# Altium schematic sheet Gate_Drive.SchDoc
size A4
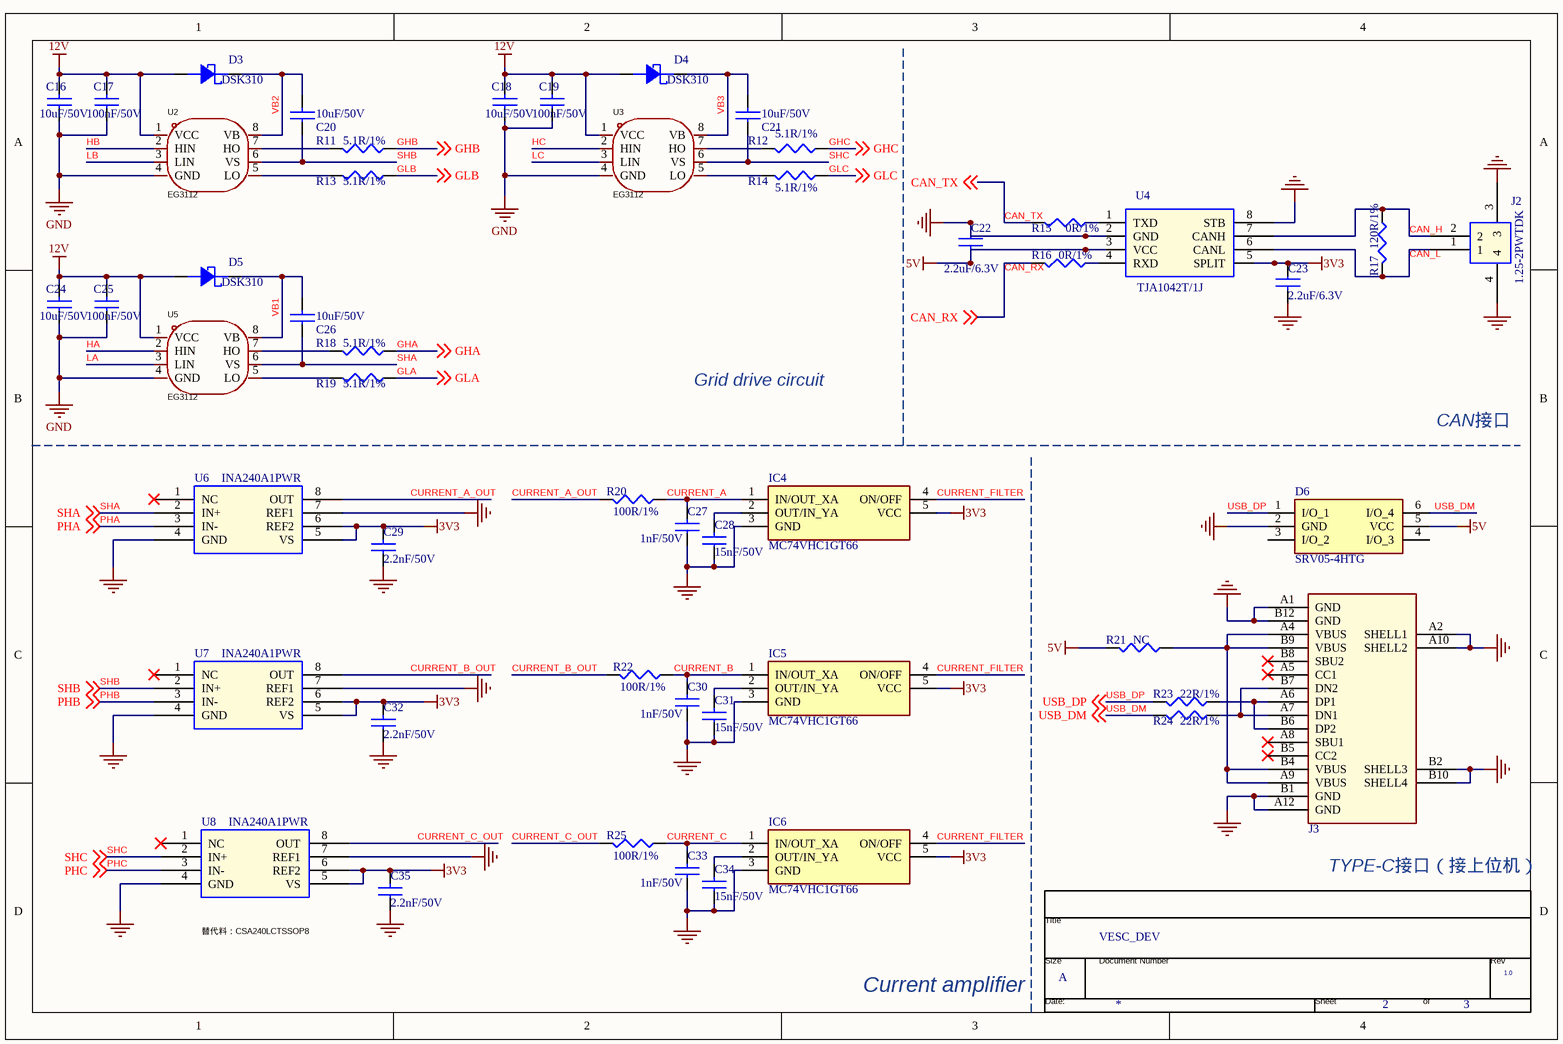
[diagram p0: Gate_Drive.SchDoc]

## Parts
*  Page Count: 3  Page Number: 2  Page Size: A  Title: VESC_DEV  RevCode: 1.0  (hidden comment: TitleBlock0)  (graphical)
C16  10uF/50V  [C0603]
C17  100nF/50V  [C0603]
C18  10uF/50V  [C0603]
C19  100nF/50V  [C0603]
C20  10uF/50V  [C0603]
C21  10uF/50V  [C0603]
C22  2.2uF/6.3V  [C0402]
C23  2.2uF/6.3V  [C0402]
C24  10uF/50V  [C0603]
C25  100nF/50V  [C0603]
C26  10uF/50V  [C0603]
C27  1nF/50V  [C0402]
C28  15nF/50V  [C0402]
C29  2.2nF/50V  [C0402]
C30  1nF/50V  [C0402]
C31  15nF/50V  [C0402]
C32  2.2nF/50V  [C0402]
C33  1nF/50V  [C0402]
C34  15nF/50V  [C0402]
C35  2.2nF/50V  [C0402]
D3  DSK310  [SOD-123F]
D4  DSK310  [SOD-123F]
D5  DSK310  [SOD-123F]
D6  SRV05-4HTG  [SOT95P280X145-6N]
IC4  MC74VHC1GT66  [SOT95P275X110-5N]
IC5  MC74VHC1GT66  [SOT95P275X110-5N]
IC6  MC74VHC1GT66  [SOT95P275X110-5N]
J2  1.25-2PWTDK  [SMD-2P-1_25]
J3  TYPE-C 16PLC-H10.0  [TYPE-C-TH_16PLC-H10.0]  (value not drawn)
R11  5.1R/1%  [R0603]
R12  5.1R/1%  [R0603]
R13  5.1R/1%  [R0603]
R14  5.1R/1%  [R0603]
R15  0R/1%  [R0402]
R16  0R/1%  [R0402]
R17  120R/1%  [R0402]
R18  5.1R/1%  [R0603]
R19  5.1R/1%  [R0603]
R20  100R/1%  [R0402]
R21  NC  [R0603]
R22  100R/1%  [R0402]
R23  22R/1%  [R0402]
R24  22R/1%  [R0402]
R25  100R/1%  [R0402]
U2  EG3112  [SOIC-8_L4.9-W3.9-P1.27-LS6.0-BL]
U3  EG3112  [SOIC-8_L4.9-W3.9-P1.27-LS6.0-BL]
U4  TJA1042T/1J  [SOP-8]
U5  EG3112  [SOIC-8_L4.9-W3.9-P1.27-LS6.0-BL]
U6  INA240A1PWR  [TSSOP-8]
U7  INA240A1PWR  [TSSOP-8]
U8  INA240A1PWR  [TSSOP-8]

## Nets
3V3: C23.1 C29.2 C32.2 C35.2 IC4.5(VCC) IC5.5(VCC) IC6.5(VCC) U4.5(SPLIT) U6.5(VS) U6.6(REF2) U7.5(VS) U7.6(REF2) U8.5(VS) U8.6(REF2)
5V: C22.2 D6.5(VCC) R21.2 U4.3(VCC)
12V: C16.2 C17.2 C18.2 C19.2 C24.2 C25.2 D3.2(A) D4.2(A) D5.2(A) U2.1(VCC) U3.1(VCC) U5.1(VCC)
GND: C16.1 C17.1 C18.1 C19.1 C22.1 C23.2 C24.1 C25.1 C27.1 C28.1 C29.1 C30.1 C31.1 C32.1 C33.1 C34.1 C35.1 D6.2(GND) IC4.3(GND) IC5.3(GND) IC6.3(GND) J2.3 J2.4 J3.A1(GND) J3.A2(SHELL1) J3.A10(SHELL2) J3.A12(GND) J3.B1(GND) J3.B2(SHELL3) J3.B10(SHELL4) J3.B12(GND) U2.4(GND) U3.4(GND) U4.2(GND) U4.8(STB) U5.4(GND) U6.4(GND) U6.7(REF1) U7.4(GND) U7.7(REF1) U8.4(GND) U8.7(REF1)
CAN_H: J2.2 R17.1 U4.7(CANH)
CAN_L: J2.1 R17.2 U4.6(CANL)
CAN_RX: R16.2 ; off-sheet CAN_RX
CAN_TX: R15.2 ; off-sheet CAN_TX
CURRENT_A: C27.2 IC4.1(IN/OUT_XA) R20.1
CURRENT_A_OUT: R20.2 U6.8(OUT)
CURRENT_B: C30.2 IC5.1(IN/OUT_XA) R22.1
CURRENT_B_OUT: R22.2 U7.8(OUT)
CURRENT_C: C33.2 IC6.1(IN/OUT_XA) R25.1
CURRENT_C_OUT: R25.2 U8.8(OUT)
CURRENT_FILTER: IC4.4(ON/OFF) IC5.4(ON/OFF) IC6.4(ON/OFF)
GHA: R18.1 ; off-sheet GHA
GHB: R11.1 ; off-sheet GHB
GHC: R12.1 ; off-sheet GHC
GLA: R19.1 ; off-sheet GLA
GLB: R13.1 ; off-sheet GLB
GLC: R14.1 ; off-sheet GLC
HA: U5.2(HIN)
HB: U2.2(HIN)
HC: U3.2(HIN)
LA: U5.3(LIN)
LB: U2.3(LIN)
LC: U3.3(LIN)
PHA: U6.3(IN-) ; off-sheet PHA
PHB: U7.3(IN-) ; off-sheet PHB
PHC: U8.3(IN-) ; off-sheet PHC
SHA: C26.1 U5.6(VS) U6.2(IN+) ; off-sheet SHA
SHB: C20.1 U2.6(VS) U7.2(IN+) ; off-sheet SHB
SHC: C21.1 U3.6(VS) U8.2(IN+) ; off-sheet SHC
USB_DM: D6.6(I/O_4) R24.2 ; off-sheet USB_DM
USB_DP: D6.1(I/O_1) R23.2 ; off-sheet USB_DP
VB1: C26.2 D5.1(K) U5.8(VB)
VB2: C20.2 D3.1(K) U2.8(VB)
VB3: C21.2 D4.1(K) U3.8(VB)
NetC28_2: C28.2 IC4.2(OUT/IN_YA)
NetC31_2: C31.2 IC5.2(OUT/IN_YA)
NetC34_2: C34.2 IC6.2(OUT/IN_YA)
NetJ3_A4: J3.A4(VBUS) J3.A9(VBUS) J3.B4(VBUS) J3.B9(VBUS) R21.1
NetJ3_A6: J3.A6(DP1) J3.B6(DP2) R23.1
NetJ3_A7: J3.A7(DN1) J3.B7(DN2) R24.1
NetR11_2: R11.2 U2.7(HO)
NetR12_2: R12.2 U3.7(HO)
NetR13_2: R13.2 U2.5(LO)
NetR14_2: R14.2 U3.5(LO)
NetR15_1: R15.1 U4.1(TXD)
NetR16_1: R16.1 U4.4(RXD)
NetR18_2: R18.2 U5.7(HO)
NetR19_2: R19.2 U5.5(LO)

Not connected (* = marked no-connect by the designer): D6 3(I/O_2) 4(I/O_3); J3 A5(CC1)* A8(SBU1)* B5(CC2)* B8(SBU2)*; U6 1(NC)*; U7 1(NC)*; U8 1(NC)*

## Notes on the sheet
- Grid drive circuit
- CAN接口
- (near U8) 替代料：CSA240LCTSSOP8
- (near J3) TYPE-C接口（接上位机）
- Current amplifier
- (in symbol TitleBlock0) Title; Size; Document Number; Rev; Date:; Sheet; of

## Library data of the parts
C16-C35 = CAP NP
  C16-C21 C24-C26: PCB Footprint: C0603
  C22 C23 C27-C35: PCB Footprint: C0402
D3-D5 = DIODE SCHOTTKY21: PCB Footprint: SOD-123F
D6 = SRV05-4HTG: TVS Diode (Uni-directional); Manufacturer_Name: LITTELFUSE; Datasheet Link: https://componentsearchengine.com/Datasheets/2/SRV05-4HTG.pdf; Height: 1.45mm; Manufacturer_Part_Number: SRV05-4HTG; Mouser Part Number: 576-SRV05-4HTG; Mouser Price/Stock: https://www.mouser.co.uk/ProductDetail/Littelfuse/SRV05-4HTG?qs=TI15CVqcli3Liexbf3C%2FVA%3D%3D; Arrow Part Number: SRV05-4HTG; Arrow Price/Stock: https://www.arrow.com/en/products/srv05-4htg/littelfuse?region=nac
IC4-IC6 = MC74VHC1GT66: Integrated Circuit; Manufacturer_Name: onsemi; Datasheet Link: https://pdf1.alldatasheet.com/datasheet-pdf/view/148919/ETL/MC74VHC1GT66.html; Height: 1.1mm; Manufacturer_Part_Number: MC74VHC1GT66; Mouser Part Number: N/A; Mouser Price/Stock: https://www.mouser.co.uk/ProductDetail/onsemi/MC74VHC1GT66?qs=YA77FY0Msbu77w80Y0DYXA%3D%3D
J3 = TYPE-C 16PLC-H10.0: 连接器类型:Type-C;标准:USB 3.1;公母:母;安装方式:直插;触点数量:16P;端口数量:1;额定电流 - 电源:5A;触头材质:-;触头镀层:-;工作温度范围:-40℃~+85℃;; Manufacturer: SHOU HAN(首韩); Add into BOM: yes; Gender: 母; Number of Contacts: 16P; Number of Ports: 1; Current Rating - Power (Max): 5A; Rated Voltage (Max): 20V; Connect-Disconnect Life: 1万次; Core Colour: 黑色; Symbol: TYPE-C 16PLC-H10.0; Device: TYPE-C 16PLC-H10.0; LCSC Part Name: Type-C 母 直插; Supplier Part: C3151747; Manufacturer Part: TYPE-C 16PLC-H10.0; Supplier Footprint: 插件; Datasheet: https://atta.szlcsc.com/upload/public/pdf/source/20240529/CC9428849977884A813B584EA396EFE9.pdf; Supplier: LCSC; Convert to PCB: yes; Connector Type: Type-C; Standard: USB 3.1; Mounting Style: 直插; Contact Material: -; Contact Plating: -; Operating Temperature Range: -40℃~+85℃
R11-R14 R18 R19 = RESISTOR: PCB Footprint: R0402
R15-R17 R20-R25 = RESISTOR
  R15-R17 R20 R22-R25: PCB Footprint: R0402
  R21: PCB Footprint: R0603
U2 U3 U5 = EG3112: Manufacturer: EG(屹晶微); Add into BOM: yes; Symbol: EG3112; Device: EG3112; LCSC Part Name: EG3112; Supplier Part: C111908; Manufacturer Part: EG3112; Supplier Footprint: SOIC-8; JLCPCB Part Class: Extended Part; Datasheet: https://atta.szlcsc.com/upload/public/pdf/source/20230725/3992D5BD05E91E0CBB5D3EE72F4B3B26.pdf; Supplier: LCSC; Convert to PCB: yes
* = TitleBlock0: Page Create Date: March  8, 1995; Page Modify Date: *
J2 = 1.25-2PWTDK: PCB Footprint: SMD-2P-1_25
U4 = TJA1042T/1J: PCB Footprint: SOP-8
U6-U8 = INA240A1PWR: PCB Footprint: TSSOP-8